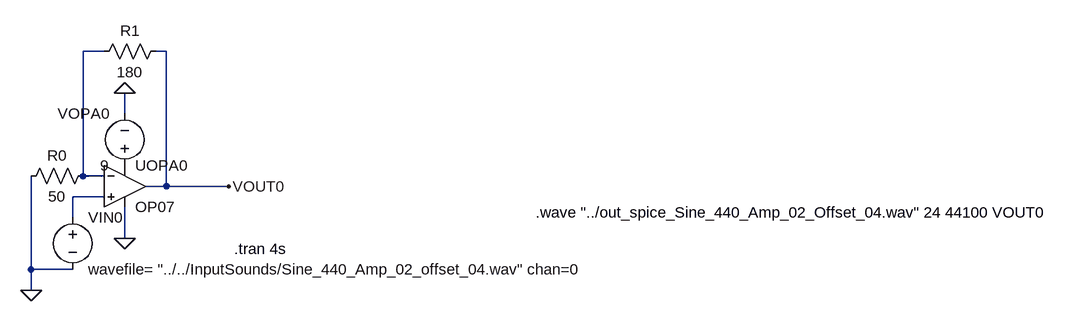
[diagram p0: schematic OpampAmpStage.asc]
OpampAmpStage.asc, the LTspice schematic file:
Version 4
SHEET 1 2036 680
WIRE 448 112 416 112
WIRE 544 112 528 112
WIRE 480 208 480 176
WIRE 416 304 416 112
WIRE 448 304 416 304
WIRE 544 320 544 112
WIRE 544 320 512 320
WIRE 640 320 544 320
WIRE 448 336 400 336
WIRE 400 368 400 336
WIRE 480 400 480 352
WIRE 336 448 336 304
WIRE 400 448 336 448
WIRE 336 480 336 448
FLAG 336 480 0
FLAG 640 320 VOUT0
FLAG 480 400 0
FLAG 480 176 0
SYMBOL /res 432 288 R90
WINDOW 0 0 56 VBottom 2
WINDOW 3 32 56 VTop 2
SYMATTR InstName R0
SYMATTR Value 50
SYMBOL /res 544 96 R90
WINDOW 0 0 56 VBottom 2
WINDOW 3 32 56 VTop 2
SYMATTR InstName R1
SYMATTR Value 180
SYMBOL /voltage 400 352 R0
SYMATTR InstName VIN0
SYMATTR Value wavefile= "../../InputSounds/Sine_440_Amp_02_offset_04.wav" chan=0
SYMBOL /Opamps/OP07 480 256 R0
SYMATTR InstName UOPA0
SYMBOL /voltage 480 304 R180
WINDOW 0 24 96 Left 2
WINDOW 3 24 16 Left 2
SYMATTR InstName VOPA0
SYMATTR Value 9
TEXT 648 416 Left 2 !.tran 4s
TEXT 1112 360 Left 2 !.wave "../out_spice_Sine_440_Amp_02_Offset_04.wav" 24 44100 VOUT0

The netlist it stands for:
* OpampAmpStage.asc
R0 N001 0 50
R1 VOUT0 N001 180
VIN0 N002 0 wavefile= "../../InputSounds/Sine_440_Amp_02_offset_04.wav" chan=0
XUOPA0 N002 N001 P001 0 VOUT0 LT1001  ; OP07, pins In+ In- V+ V- OUT
VOPA0 P001 0 9
.tran 4s
.wave "../out_spice_Sine_440_Amp_02_Offset_04.wav" 24 44100 VOUT0
.lib LTC.lib
.backanno
.end